# EasyEDA Pro project ProPrj_课设-温湿度传感器_2025-12-05.epro

# Schematic Schematic1
Board Name: Board1; Create Date: 2025-11-25; Page Name: P1; Project Name: 课设-温湿度传感器; Schematic Name: Schematic1; Update Date: 2025-11-25; Company: 嘉立创EDA; Page Size: A4; Version: V1.0
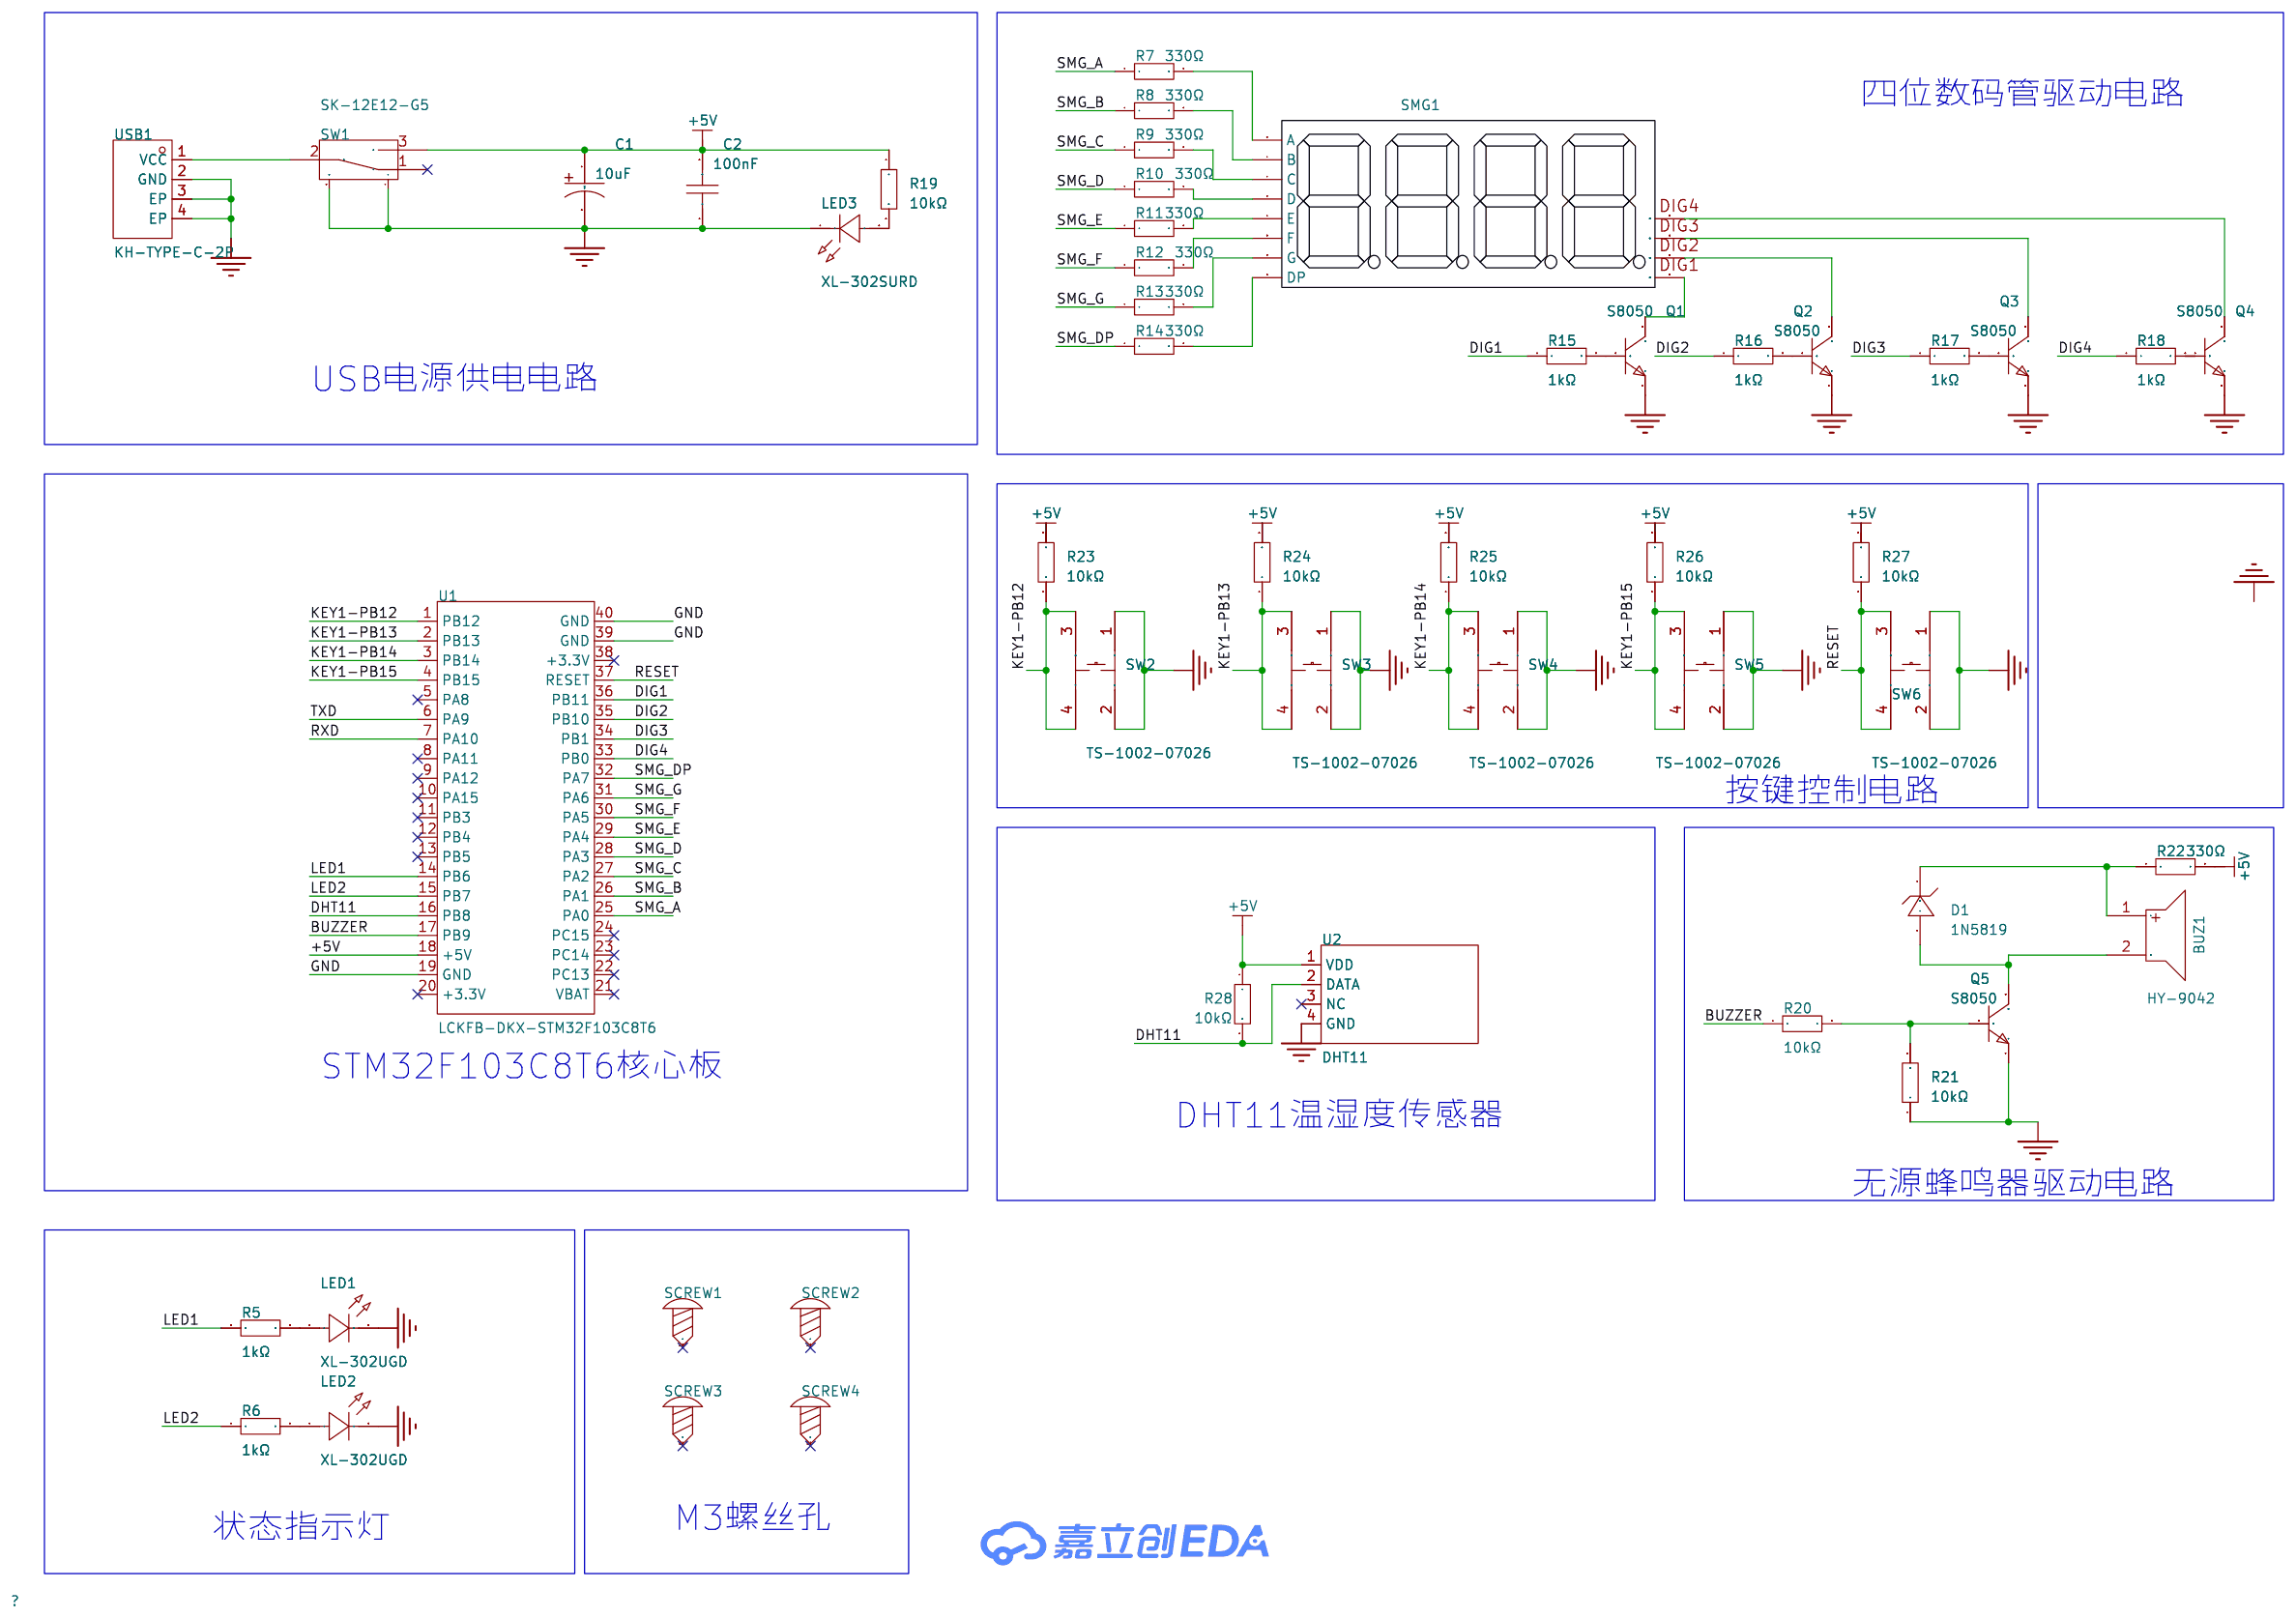
[diagram p0: schematic sheet]

## Parts
BUZ1  HY-9042  [BUZ-TH_BD9.0-P4.00-D0.6-FD]
C1  10uF  [CAP-TH_BD4.0-P1.50-D0.8-FD]
C2  100nF  [CAP-TH_L5.0-W2.5-P5.08-D0.7]
D1  1N5819  [DO-41_BD2.4-L4.7-P8.70-D0.9-RD]
LED1  XL-302UGD  [LED-TH_BD3.8-P2.54-FD_GREEN]
LED2  XL-302UGD  [LED-TH_BD3.8-P2.54-FD_GREEN]
LED3  XL-302SURD  [LED-TH_BD3.8-P2.54-RD]
Q1  S8050  [TO-92-3_L4.5-W3.5-P1.27-L]
Q2  S8050  [TO-92-3_L4.5-W3.5-P1.27-L]
Q3  S8050  [TO-92-3_L4.5-W3.5-P1.27-L]
Q4  S8050  [TO-92-3_L4.5-W3.5-P1.27-L]
Q5  S8050  [TO-92-3_L4.5-W3.5-P1.27-L]
R5  1kΩ  [RES-TH_BD2.2-L6.5-P10.50-D0.6]
R6  1kΩ  [RES-TH_BD2.2-L6.5-P10.50-D0.6]
R7  330Ω  [RES-TH_BD2.2-L6.5-P10.50-D0.6]
R8  330Ω  [RES-TH_BD2.2-L6.5-P10.50-D0.6]
R9  330Ω  [RES-TH_BD2.2-L6.5-P10.50-D0.6]
R10  330Ω  [RES-TH_BD2.2-L6.5-P10.50-D0.6]
R11  330Ω  [RES-TH_BD2.2-L6.5-P10.50-D0.6]
R12  330Ω  [RES-TH_BD2.2-L6.5-P10.50-D0.6]
R13  330Ω  [RES-TH_BD2.2-L6.5-P10.50-D0.6]
R14  330Ω  [RES-TH_BD2.2-L6.5-P10.50-D0.6]
R15  1kΩ  [RES-TH_BD2.2-L6.5-P10.50-D0.6]
R16  1kΩ  [RES-TH_BD2.2-L6.5-P10.50-D0.6]
R17  1kΩ  [RES-TH_BD2.2-L6.5-P10.50-D0.6]
R18  1kΩ  [RES-TH_BD2.2-L6.5-P10.50-D0.6]
R19  10kΩ  [RES-TH_BD2.4-L6.3-P10.30-D0.6]
R20  10kΩ  [RES-TH_BD2.4-L6.3-P10.30-D0.6]
R21  10kΩ  [RES-TH_BD2.4-L6.3-P10.30-D0.6]
R22  330Ω  [RES-TH_BD2.2-L6.5-P10.50-D0.6]
R23  10kΩ  [RES-TH_BD2.4-L6.3-P10.30-D0.6]
R24  10kΩ  [RES-TH_BD2.4-L6.3-P10.30-D0.6]
R25  10kΩ  [RES-TH_BD2.4-L6.3-P10.30-D0.6]
R26  10kΩ  [RES-TH_BD2.4-L6.3-P10.30-D0.6]
R27  10kΩ  [RES-TH_BD2.4-L6.3-P10.30-D0.6]
R28  10kΩ  [RES-TH_BD2.4-L6.3-P10.30-D0.6]
SCREW1  -  [M3螺丝]
SCREW2  -  [M3螺丝]
SCREW3  -  [M3螺丝]
SCREW4  -  [M3螺丝]
SMG1  -  [LED-SEG-TH_FJ5461AH]
SW1  SK-12E12-G5  [SW-TH_SK-12E12-G5]
SW2  TS-1002-07026  [SW-TH_4P-L6.0-W6.0-P4.50-LS6.5]
SW3  TS-1002-07026  [SW-TH_4P-L6.0-W6.0-P4.50-LS6.5]
SW4  TS-1002-07026  [SW-TH_4P-L6.0-W6.0-P4.50-LS6.5]
SW5  TS-1002-07026  [SW-TH_4P-L6.0-W6.0-P4.50-LS6.5]
SW6  TS-1002-07026  [SW-TH_4P-L6.0-W6.0-P4.50-LS6.5]
U1  LCKFB-DKX-STM32F103C8T6  [CONN-TH_L53.3-W22.9_STM32F103C8T6-CARD]
U2  DHT11  [SENSOR-TH_DHT11]
USB1  KH-TYPE-C-2P  [USB-SMD_KH-TYPE-C-2P]

## Library data of the parts
BUZ1 = HY-9042: Supplier Part: C9900019261; Supplier: LCSC
C1 = KF1E100MB050A00CV0: 容值:10uF;精度:±20%;额定电压:25V;; LCSC Part Name: 10uF ±20% 25V; Supplier Part: C216306; Manufacturer: HUAWEI(华威集团); Supplier Footprint: 插件,D4xL5mm; JLCPCB Part Class: 扩展库; Datasheet: https://atta.szlcsc.com/upload/public/pdf/source/20181022/C271305_EAB36A8975ADE9B953FB348CB9D3587F.pdf; Supplier: LCSC; Tolerance: ±20%; Rated Voltage: 25V; Lead Spacing: 1.5mm; φD: 4mm; L: 5mm; Lifetime @ Temp: 1000hrs@105℃
C2 = CC1H104ZC74D3F5O30MN: 容值:100nF;精度:-20%~+80%;额定电压:50V;温度系数:Y5V;; LCSC Part Name: 100nF -20%~+80% 50V; Supplier Part: C254094; Manufacturer: Dersonic(德尔创); Supplier Footprint: 插件,P=5.08mm; JLCPCB Part Class: 扩展库; Datasheet: https://item.szlcsc.com/datasheet/CC1H104ZC74D3F5O30MN/248644.html; Supplier: LCSC; Tolerance: -20%~+80%; Voltage Rating: 50V; Pin Spacing: 5.08mm; Temperature Coefficient: Y5V; Diameter: 5.3mm; Body Thickness: 2.2mm
D1 = 1N5819_C402218: 二极管配置:独立式;正向压降(Vf):900mV@3A;直流反向耐压(Vr):40V;整流电流:1A;; LCSC Part Name: 电压:40V 电流:1A; Supplier Part: C402218; Manufacturer: LGE(鲁光); Supplier Footprint: DO-41; JLCPCB Part Class: 扩展库; Datasheet: https://item.szlcsc.com/datasheet/1N5819/387363.html; Supplier: LCSC; Diode Configuration: 独立式; Voltage - Forward(Vf@If): 900mV@3A; Voltage - DC Reverse(Vr): 40V; Current - Rectified: 1A; Reverse Leakage Current (Ir): 1mA@40V; Operating Junction Temperature Range: -65℃~+125℃; Non-Repetitive Peak Forward Surge Current: 30A
LED1 LED2 = XL-302UGD: 灯头类型:3mm圆形灯头;发光颜色:翠绿色;正向压降(Vf):3.6V;功率:70mW;正向电流:20mA;波长:520nm~530nm;透镜颜色:绿色透镜;色温:-;发光强度:3000mcd;发光角度:30°;载带方式:-;工作温度:-20℃~+85℃;; LCSC Part Name: 绿发翠绿短脚LED; Supplier Part: C2895476; Manufacturer: XINGLIGHT(成兴光); Supplier Footprint: 插件,D=3mm; JLCPCB Part Class: 扩展库; Datasheet: https://item.szlcsc.com/datasheet/XL-302UGD/3136191.html; Supplier: LCSC; Lamp Holder Type: 3mm圆形灯头; Illumination Color: 翠绿色; Voltage - Forward(Vf): 3.6V; Power(Watts): 70mW; Forward Current: 20mA; Wavelength - Dominant: 520nm~530nm; Peak Wavelength: 520nm; Lens Color: 绿色透镜; Luminous Intensity: 3000mcd; Viewing Angle: 30°; Operating Temperature: -20℃~+85℃
LED3 = XL-302SURD: 灯头类型:3mm圆形灯头;发光颜色:红色;正向压降(Vf):2.2V;功率:50mW;正向电流:20mA;波长:620nm~630nm;二极管配置:-;透镜颜色:红色透镜;色温:-;发光强度:1000mcd;发光角度:35°;载带方式:-;工作温度:-20℃~+85℃;; Supplier Part: C2895470; Manufacturer: XINGLIGHT(成兴光); Supplier Footprint: 插件,D=3mm; JLCPCB Part Class: 扩展库; Datasheet: https://item.szlcsc.com/datasheet/XL-302SURD/3136185.html; Supplier: LCSC; Lamp Holder Type: 3mm圆形灯头; Illumination Color: 红色; Voltage - Forward(Vf): 2.2V; Power(Watts): 50mW; Forward Current: 20mA; Wavelength - Dominant: 620nm~630nm; Peak Wavelength: 625nm; Lens Color: 红色透镜; Luminous Intensity: 1000mcd; Viewing Angle: 35°; Operating Temperature: -20℃~+85℃
Q1-Q5 = S8050_C2931492: 晶体管类型:NPN;集电极电流(Ic):500mA;集射极击穿电压(Vceo):25V;耗散功率(Pd):625mW;直流电流增益(hFE):160@50mA,1V;; LCSC Part Name: NPN 电流:500mA 电压:25V; Supplier Part: C2931492; Manufacturer: JSMSEMI(杰盛微); Supplier Footprint: TO-92; JLCPCB Part Class: 扩展库; Datasheet: https://item.szlcsc.com/datasheet/S8050/3272796.html; Supplier: LCSC; type: NPN; Current - Collector(Ic): 500mA; Collector - Emitter Voltage VCEO: 25V; Pd - Power Dissipation: 625mW; DC Current Gain: 160@50mA,1V; Transition frequency(fT): 150MHz; Current - Collector Cutoff: 100nA; Vce Saturation(VCE(sat)): 600mV@500mA,50mA; Emitter-Base Voltage(Vebo): 5V
R5 R6 R15-R18 = MFR-25JT-52-1K: 电阻类型:金属膜电阻;阻值:1kΩ;精度:±5%;功率:250mW;; LCSC Part Name: 金属膜电阻 1kΩ ±5% 250mW 铜脚，圆柱状直插; Supplier Part: C176465; Manufacturer: YAGEO(国巨); Supplier Footprint: 插件,D2.4xL6.3mm; JLCPCB Part Class: 扩展库; Datasheet: https://atta.szlcsc.com/upload/public/pdf/source/20191118/C457825_18355E864DE4965678DC27B0EBC3E21E.pdf; Supplier: LCSC; Type: 金属膜电阻; Tolerance: ±5%; Power(Watts): 250mW; Operating Temperature: -55℃~+155℃
R7-R14 R22 = MFR-25FTE52-330R: 电阻类型:金属膜电阻;阻值:330Ω;精度:±1%;功率:250mW;温度系数:±50ppm/℃;; LCSC Part Name: 金属膜电阻 330Ω ±1% 250mW 铜脚，圆柱状直插; Supplier Part: C138208; Manufacturer: YAGEO(国巨); Supplier Footprint: 插件,D2.4xL6.3mm; JLCPCB Part Class: 扩展库; Datasheet: https://atta.szlcsc.com/upload/public/pdf/source/20191118/C457825_18355E864DE4965678DC27B0EBC3E21E.pdf; Supplier: LCSC; Type: 金属膜电阻; Tolerance: ±1%; Power(Watts): 250mW; Temperature Coefficient: ±50ppm/℃; Operating Temperature: -55℃~+155℃
R19-R21 R23-R28 = MFR-25JT-52-10K: 电阻类型:金属膜电阻;阻值:10kΩ;精度:±5%;功率:250mW;; LCSC Part Name: 金属膜电阻 10kΩ ±5% 250mW 铜脚，圆柱状直插; Supplier Part: C176451; Manufacturer: YAGEO(国巨); Supplier Footprint: 插件,D2.4xL6.3mm; JLCPCB Part Class: 扩展库; Datasheet: https://item.szlcsc.com/datasheet/MFR-25JT-52-10K/187841.html; Supplier: LCSC; Type: 金属膜电阻; Tolerance: ±5%; Power(Watts): 250mW; Operating Temperature: -55℃~+155℃
SCREW1-SCREW4 = M3螺丝: Supplier Footprint: 插件
SMG1 = LED_SEG_TH_0.56x4: Supplier Footprint: 插件
SW1 = SK-12E12-G5: 电路结构:单刀双掷;安装方式:-;额定电流:-;额定电压:-;工作寿命:5千次;; LCSC Part Name: 卧插双档 滑动开关; Supplier Part: C136720; Manufacturer: 韩国韩荣; Supplier Footprint: 插件; JLCPCB Part Class: 扩展库; Datasheet: https://item.szlcsc.com/datasheet/SK-12E12-G5/148036.html; Supplier: LCSC; Circuit: 单刀双掷; Actuator Style: 矩形柱状; Termination Style: PC引脚; Switch Height: 10.6mm; Life: 5千次; Operating Temperature: -25℃~+70℃
SW2-SW6 = TS-1002-07026: 电路结构:单刀单掷;按钮形状:圆形按钮;安装方式:直插;开关长度:6mm;开关宽度:6mm;开关高度:7mm;触点电流:50mA;额定电压:12V;带灯:-;工作寿命:-;; LCSC Part Name: 6*6*7mm 直插 轻触开关; Supplier Part: C455095; Manufacturer: XUNPU(讯普); Supplier Footprint: 插件,6x6mm; JLCPCB Part Class: Extended Part; Datasheet: https://item.szlcsc.com/datasheet/TS-1002-07026/457500.html; Supplier: LCSC; Circuit: 单刀单掷; Actuator Style: 圆形按钮; Mounting Type: 直插; Length: 6mm; Width: 6mm; Switch Height: 7mm; Contact Current: 50mA; Voltage Rating: 12V
U1 = LCKFB-DKX-STM32F103C8T6: LCSC Part Name: 立创·地阔星-STM32F103C8T6开发板; Supplier Part: C22396880; Manufacturer: 立创开发板; JLCPCB Part Class: 扩展库; Datasheet: https://item.szlcsc.com/datasheet/LCKFB-DKX-STM32F103C8T6/24005615.html; Supplier: LCSC
U2 = DHT11: 新款电容式数字温湿度传感器,老款已停产16.1x12.6x5.8mm; LCSC Part Name: 新款电容式数字温湿度传感器,老款已停产16.1x12.6x5.8mm DHT11  电容式传感器; Supplier Part: C117051; Manufacturer: 广州奥松; Supplier Footprint: SIP-4; JLCPCB Part Class: 扩展库; Datasheet: https://atta.szlcsc.com/upload/public/pdf/source/20170703/1499081238365.pdf; Supplier: LCSC
USB1 = KH-TYPE-C-2P: 连接器类型:Type-C;协议标准:-;公母:-;安装方式:-;触点数量:2P;端口数量:-;额定电流 - 电源:-;工作温度:-;; LCSC Part Name: Type-C; Supplier Part: C2919656; Manufacturer: kinghelm(金航标); Supplier Footprint: 插件; JLCPCB Part Class: 扩展库; Datasheet: https://item.szlcsc.com/datasheet/KH-TYPE-C-2P/3222638.html; Supplier: LCSC; Connector Type: Type-C; Number of Contacts: 2P

## Nets
+5V: C1.1 C2.2 R19.1 R22.2 R23.2 R24.2 R25.2 R26.2 R27.2 R28.1 SW1.3 U1.18(+5V) U2.1(VDD)
GND: C1.2 C2.1 LED1.2(K) LED2.2(K) LED3.1(K) Q1.1(E) Q2.1(E) Q3.1(E) Q4.1(E) Q5.1(E) R21.1 SW1.4 SW1.5 SW2.1 SW2.2 SW3.1 SW3.2 SW4.1 SW4.2 SW5.1 SW5.2 SW6.1 SW6.2 U1.19(GND) U1.39(GND) U1.40(GND) U2.4(GND) USB1.2(GND) USB1.3(EP) USB1.4(EP)
BUZZER: R20.1 U1.17(PB9)
DHT11: R28.2 U1.16(PB8) U2.2(DATA)
DIG1: R15.1 U1.36(PB11)
DIG2: R16.1 U1.35(PB10)
DIG3: R17.1 U1.34(PB1)
DIG4: R18.1 U1.33(PB0)
KEY1-PB12: R23.1 SW2.3 SW2.4 U1.1(PB12)
KEY1-PB13: R24.1 SW3.3 SW3.4 U1.2(PB13)
KEY1-PB14: R25.1 SW4.3 SW4.4 U1.3(PB14)
KEY1-PB15: R26.1 SW5.3 SW5.4 U1.4(PB15)
LED1: R5.1 U1.14(PB6)
LED2: R6.1 U1.15(PB7)
RESET: R27.1 SW6.3 SW6.4 U1.37(RESET)
RXD: U1.7(PA10)
SMG_A: R7.1 U1.25(PA0)
SMG_B: R8.1 U1.26(PA1)
SMG_C: R9.1 U1.27(PA2)
SMG_D: R10.1 U1.28(PA3)
SMG_DP: R14.1 U1.32(PA7)
SMG_E: R11.1 U1.29(PA4)
SMG_F: R12.1 U1.30(PA5)
SMG_G: R13.1 U1.31(PA6)
TXD: U1.6(PA9)
$1N1388: R7.2 SMG1.11(A)
$1N1393: R8.2 SMG1.7(B)
$1N1403: R9.2 SMG1.4(C)
$1N1413: R10.2 SMG1.2(D)
$1N1419: R11.2 SMG1.1(E)
$1N1425: R12.2 SMG1.10(F)
$1N1432: R13.2 SMG1.5(G)
$1N1474: R14.2 SMG1.3(DP)
$1N1913: Q1.3(C) SMG1.12(DIG1)
$1N1916: Q1.2(B) R15.2
$1N1920: Q2.3(C) SMG1.9(DIG2)
$1N1925: Q3.3(C) SMG1.8(DIG3)
$1N1934: Q4.3(C) SMG1.6(DIG4)
$1N1943: Q2.2(B) R16.2
$1N1945: Q3.2(B) R17.2
$1N1947: Q4.2(B) R18.2
$1N2445: SW1.2 USB1.1(VCC)
$1N2605: LED3.2(A) R19.2
$1N2609: LED1.1(A) R5.2
$1N2614: LED2.1(A) R6.2
$1N3034: Q5.2(B) R20.2 R21.2
$1N3101: BUZ1.2 D1.2(A) Q5.3(C)
$1N3230: BUZ1.1 D1.1(C) R22.1

Not connected (* = marked no-connect by the designer): SCREW1 1*; SCREW2 1*; SCREW3 1*; SCREW4 1*; SW1 1*; U1 5(PA8)* 8(PA11)* 9(PA12)* 10(PA15)* 11(PB3)* 12(PB4)* 13(PB5)* 20(+3.3V)* 21(VBAT)* 22(PC13)* 23(PC14)* 24(PC15)* 38(+3.3V)*; U2 3(NC)*

## Notes on the sheet
- 四位数码管驱动电路
- USB电源供电电路
- 按键控制电路
- STM32F103C8T6核心板
- DHT11温湿度传感器
- 无源蜂鸣器驱动电路
- 状态指示灯
- M3螺丝孔

# Board PCB1
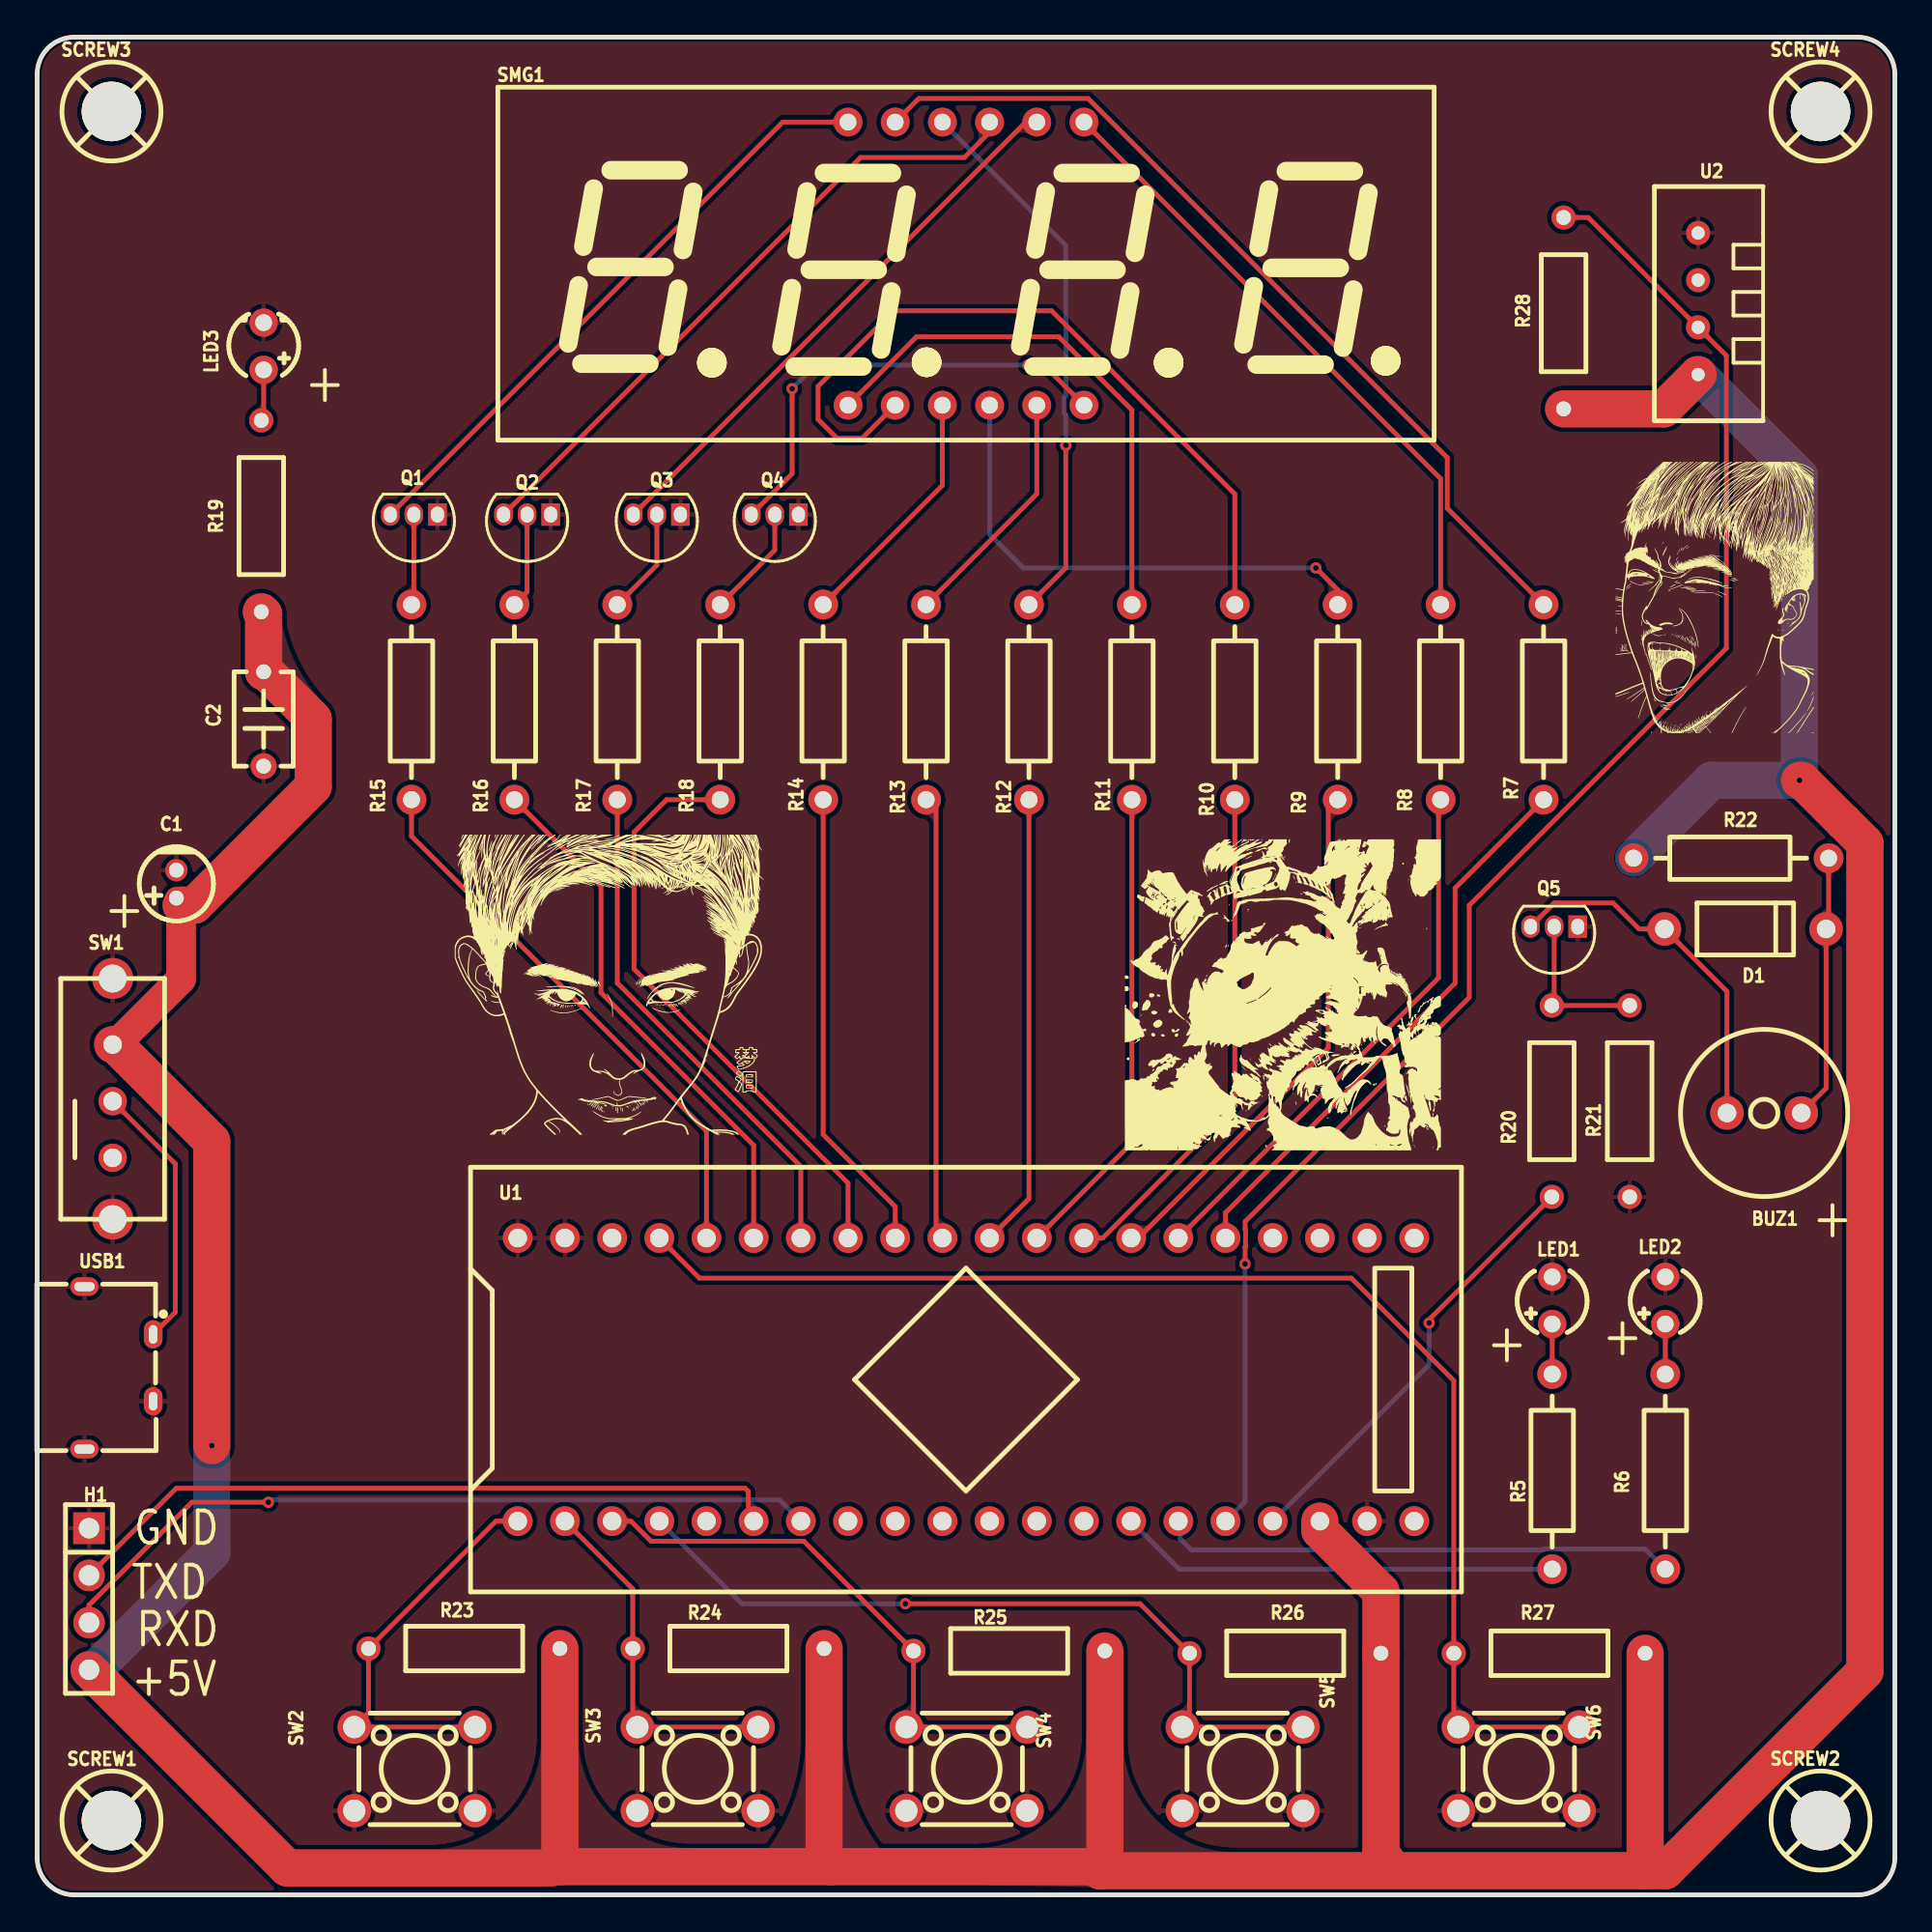
[diagram p1: board, top side]
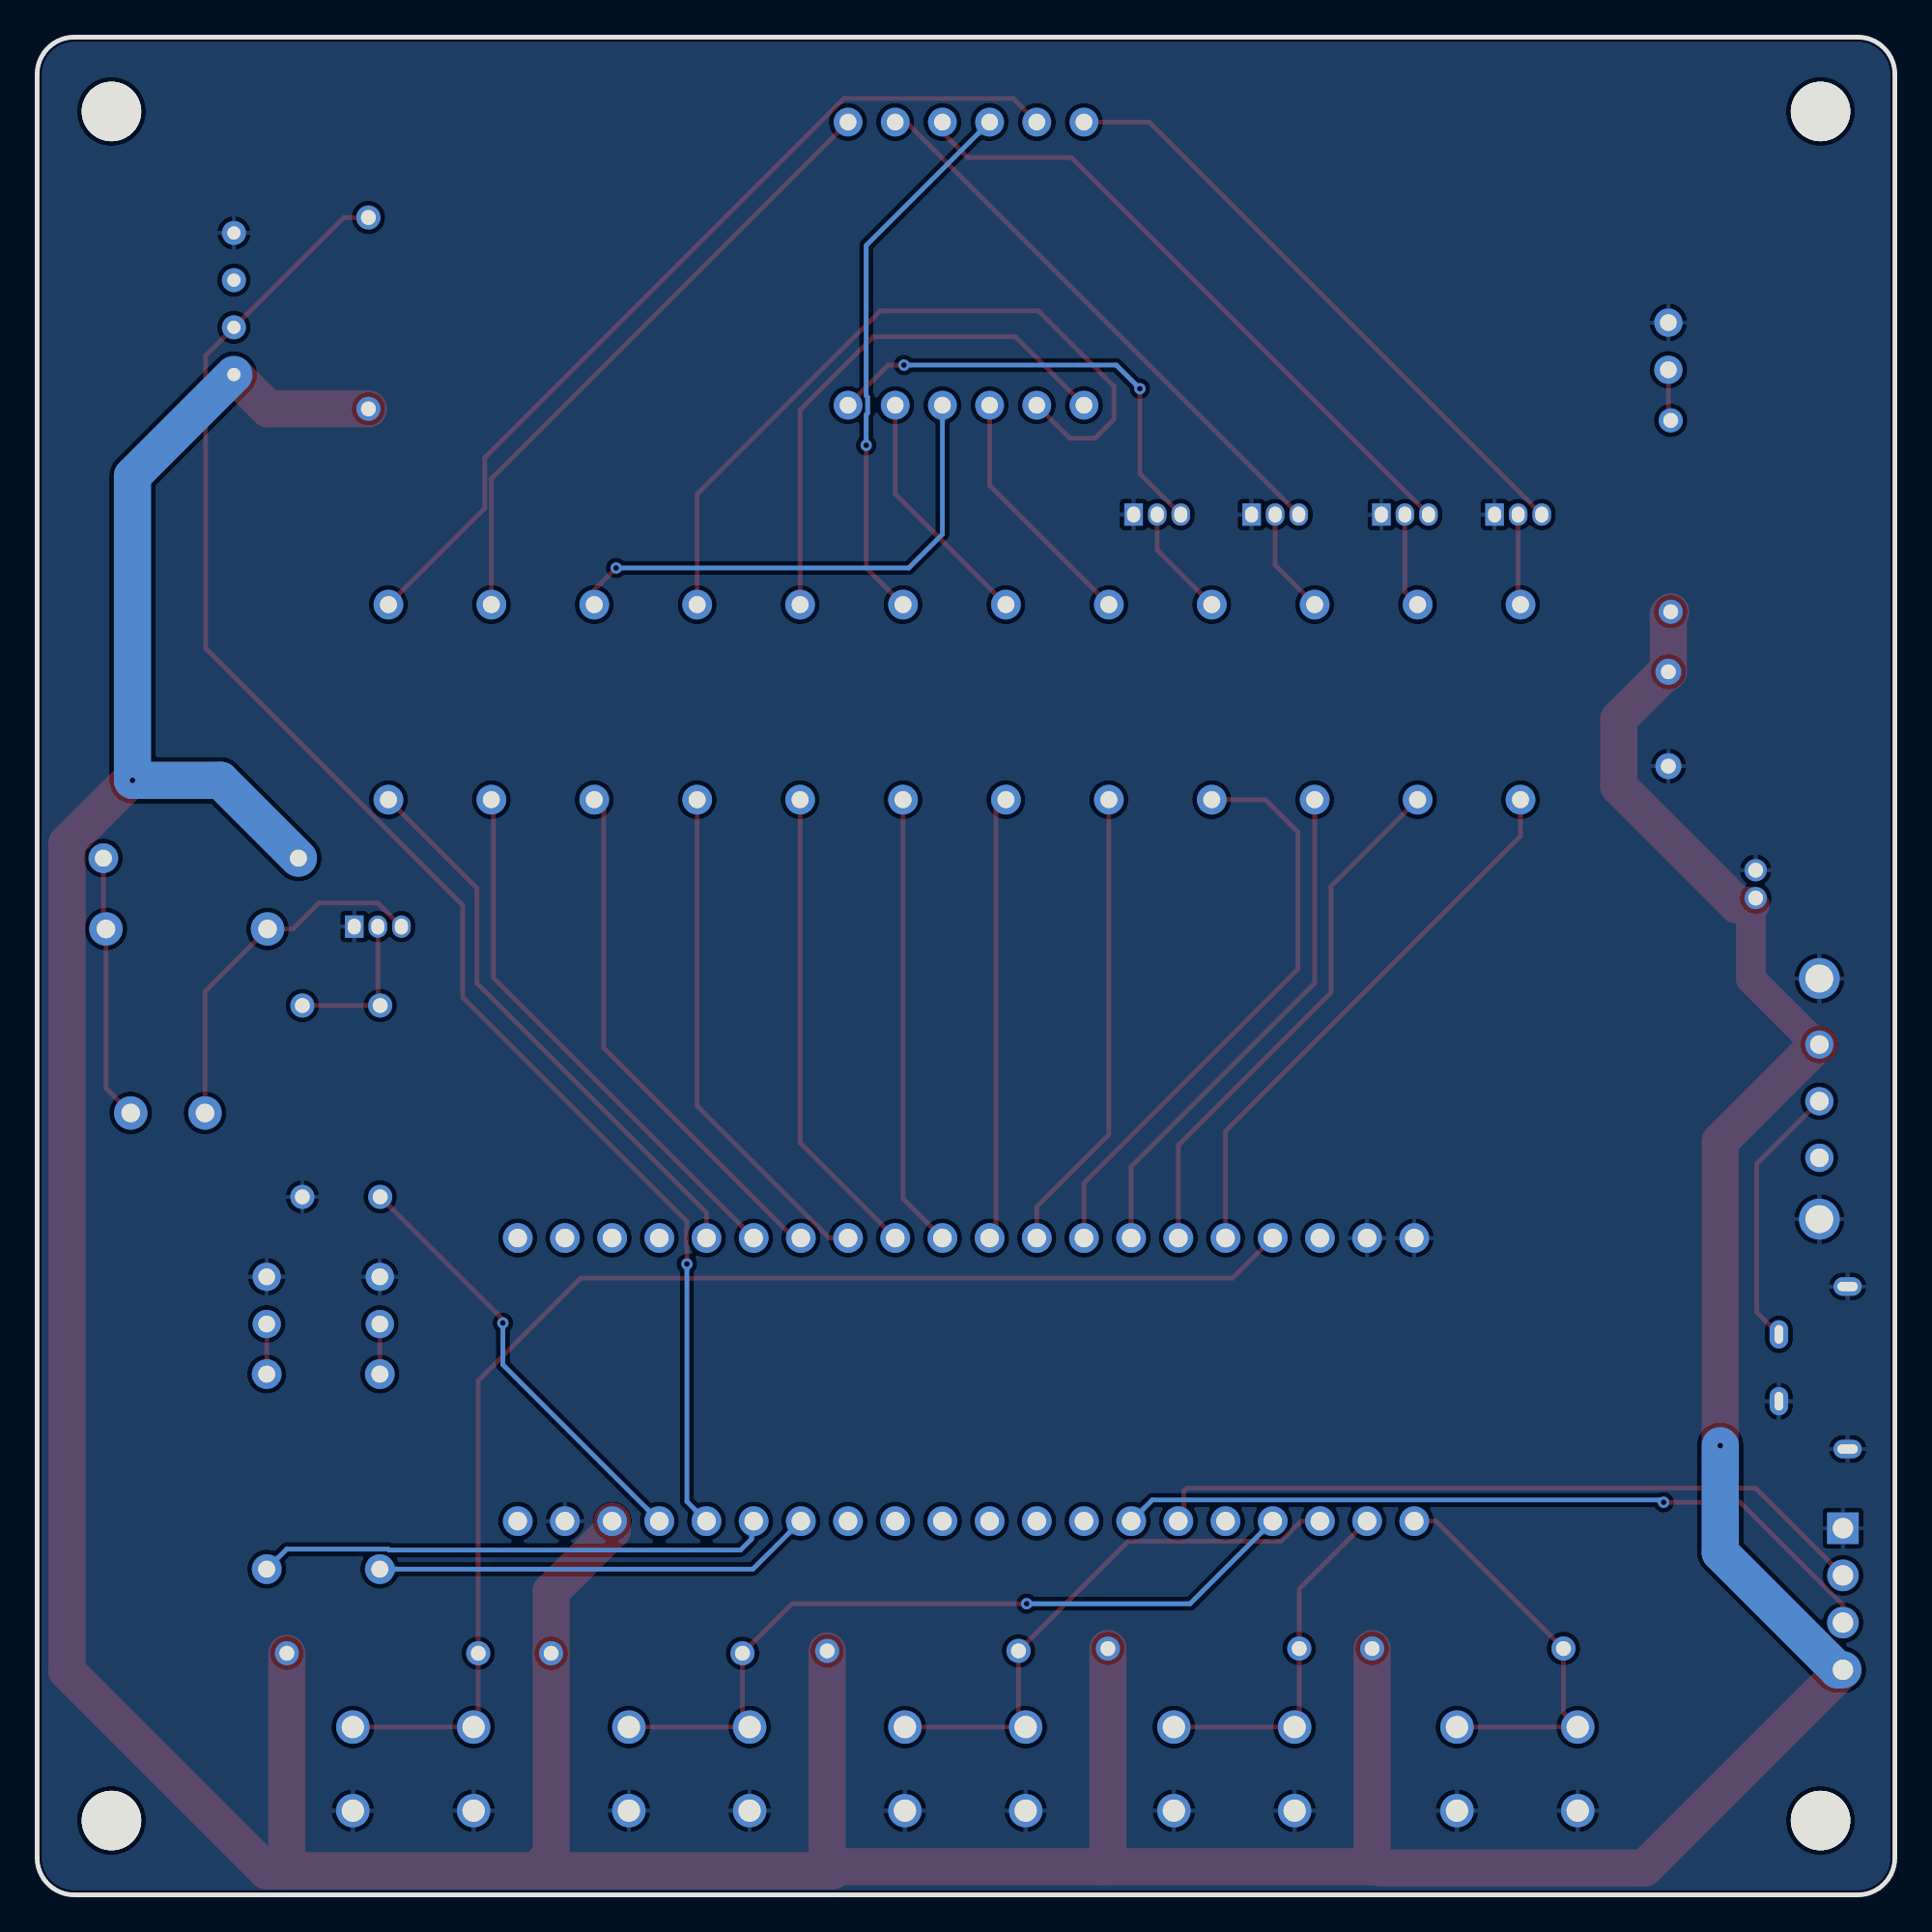
[diagram p2: board, bottom side, seen from below]

Outline 100 x 100 mm; copper layers: Top Layer, Bottom Layer. Coordinates in mm from the lower left corner of the outline.
Outline path: 0,98 0,2 arc(0.59,0.59) 2,0 98,0 arc(99.41,0.59) 100,2 100,98 arc(99.41,99.41) 98,100 2,100 arc(0.59,99.41) 0,98
Stack: Top Layer 0.035mm / Dielectric1 1.51mm FR4 er 4.5 / Bottom Layer 0.035mm

## Design rules (mm)
template: JLCPCB Capability(Two Layers Board)
spacing copperThickness1oz (default): track to track 0.102, other pairs 0.152 to 0.3
spacing copperThickness2oz: track to track 0.203, other pairs 0.152 to 0.3
track width copperThickness1oz (default): min 0.127, default 0.254, max 2.54
track width copperThickness2oz: min 0.203, default 0.254, max 2.54
differential pair differentialPair (default): width min 0.127, default 0.254, max 2.54; gap min 0.152, default 0.152
via viaSize (default): diameter min 0.5, default 0.61, max 10; hole min 0.3, default 0.305, max 6.3

## Placement (name value [footprint] x y rotation side)
BUZ1  HY-9042  [BUZ-TH_BD9.0-P4.00-D0.6-FD]  92.96 42.09 180 top
C1  10uF  [CAP-TH_BD4.0-P1.50-D0.8-FD]  7.49 54.41 90 top
C2  100nF  [CAP-TH_L5.0-W2.5-P5.08-D0.7]  12.19 63.3 90 top
D1  1N5819  [DO-41_BD2.4-L4.7-P8.70-D0.9-RD]  91.95 51.99 180 top
H1  PZ254V-11-04P  [HDR-TH_4P-P2.54-V-M]  2.79 15.93 270 top
LED1  XL-302UGD  [LED-TH_BD3.8-P2.54-FD_GREEN]  81.56 32 90 top
LED2  XL-302UGD  [LED-TH_BD3.8-P2.54-FD_GREEN]  87.64 32 90 top
LED3  XL-302SURD  [LED-TH_BD3.8-P2.54-RD]  12.19 83.36 270 top
Q1  S8050  [TO-92-3_L4.5-W3.5-P1.27-L]  20.28 74.3 180 top
Q2  S8050  [TO-92-3_L4.5-W3.5-P1.27-L]  26.37 74.3 180 top
Q3  S8050  [TO-92-3_L4.5-W3.5-P1.27-L]  33.36 74.3 180 top
Q4  S8050  [TO-92-3_L4.5-W3.5-P1.27-L]  39.71 74.3 180 top
Q5  S8050  [TO-92-3_L4.5-W3.5-P1.27-L]  81.66 52.12 180 top
R5  1kΩ  [RES-TH_BD2.2-L6.5-P10.50-D0.6]  81.56 22.78 90 top
R6  1kΩ  [RES-TH_BD2.2-L6.5-P10.50-D0.6]  87.64 22.78 90 top
R7  330Ω  [RES-TH_BD2.2-L6.5-P10.50-D0.6]  81.09 64.2 90 top
R8  330Ω  [RES-TH_BD2.2-L6.5-P10.50-D0.6]  75.55 64.2 90 top
R9  330Ω  [RES-TH_BD2.2-L6.5-P10.50-D0.6]  70.01 64.2 90 top
R10  330Ω  [RES-TH_BD2.2-L6.5-P10.50-D0.6]  64.47 64.2 90 top
R11  330Ω  [RES-TH_BD2.2-L6.5-P10.50-D0.6]  58.93 64.2 90 top
R12  330Ω  [RES-TH_BD2.2-L6.5-P10.50-D0.6]  53.39 64.2 90 top
R13  330Ω  [RES-TH_BD2.2-L6.5-P10.50-D0.6]  47.85 64.2 90 top
R14  330Ω  [RES-TH_BD2.2-L6.5-P10.50-D0.6]  42.31 64.2 90 top
R15  1kΩ  [RES-TH_BD2.2-L6.5-P10.50-D0.6]  20.15 64.2 90 top
R16  1kΩ  [RES-TH_BD2.2-L6.5-P10.50-D0.6]  25.69 64.2 90 top
R17  1kΩ  [RES-TH_BD2.2-L6.5-P10.50-D0.6]  31.23 64.2 90 top
R18  1kΩ  [RES-TH_BD2.2-L6.5-P10.50-D0.6]  36.77 64.2 90 top
R19  10kΩ  [RES-TH_BD2.4-L6.3-P10.30-D0.6]  12.06 74.22 90 top
R20  10kΩ  [RES-TH_BD2.4-L6.3-P10.30-D0.6]  81.53 42.72 90 top
R21  10kΩ  [RES-TH_BD2.4-L6.3-P10.30-D0.6]  85.72 42.72 90 top
R22  330Ω  [RES-TH_BD2.2-L6.5-P10.50-D0.6]  91.19 55.8 180 top
R23  10kΩ  [RES-TH_BD2.4-L6.3-P10.30-D0.6]  22.99 13.26 0 top
R24  10kΩ  [RES-TH_BD2.4-L6.3-P10.30-D0.6]  37.21 13.26 0 top
R25  10kΩ  [RES-TH_BD2.4-L6.3-P10.30-D0.6]  52.32 13.13 0 top
R26  10kΩ  [RES-TH_BD2.4-L6.3-P10.30-D0.6]  67.18 13 0 top
R27  10kΩ  [RES-TH_BD2.4-L6.3-P10.30-D0.6]  81.41 13 0 top
R28  10kΩ  [RES-TH_BD2.4-L6.3-P10.30-D0.6]  82.17 85.14 90 top
SCREW1  -  [M3螺丝]  4 4 0 top
SCREW2  -  [M3螺丝]  96 4 0 top
SCREW3  -  [M3螺丝#2]  4 96 0 top
SCREW4  -  [M3螺丝]  96 96 0 top
SMG1  -  [LED-SEG-TH_FJ5461AH]  50 87.81 0 top
SW1  SK-12E12-G5  [SW-TH_SK-12E12-G5]  4.06 42.85 180 top
SW2  TS-1002-07026  [SW-TH_4P-L6.0-W6.0-P4.50-LS6.5]  20.32 6.78 180 top
SW3  TS-1002-07026  [SW-TH_4P-L6.0-W6.0-P4.50-LS6.5]  35.56 6.78 180 top
SW4  TS-1002-07026  [SW-TH_4P-L6.0-W6.0-P4.50-LS6.5]  50.04 6.78 180 top
SW5  TS-1002-07026  [SW-TH_4P-L6.0-W6.0-P4.50-LS6.5]  64.9 6.78 180 top
SW6  TS-1002-07026  [SW-TH_4P-L6.0-W6.0-P4.50-LS6.5]  79.76 6.78 180 top
U1  LCKFB-DKX-STM32F103C8T6  [CONN-TH_L53.3-W22.9_STM32F103C8T6-CARD]  50 27.74 0 top
U2  DHT11  [SENSOR-TH_DHT11]  89.41 85.65 90 top
USB1  KH-TYPE-C-2P  [USB-SMD_KH-TYPE-C-2P]  4.39 28.37 270 top

## Footprints (pads in the part's own frame, mm; a bottom-side part is the same pattern mirrored in y, then rotated)
BUZ-TH_BD9.0-P4.00-D0.6-FD
  round 1.8 hole 1: 1(-2,0) 2(2,0)
CAP-TH_BD4.0-P1.50-D0.8-FD
  round 1.2 hole 0.8: 1(-0.75,0) 2(0.75,0)
CAP-TH_L5.0-W2.5-P5.08-D0.7
  round 1.4 hole 0.8: 1(-2.54,0) 2(2.54,0)
CONN-TH_L53.3-W22.9_STM32F103C8T6-CARD
  round 1.6 hole 1: 1(-24.13,-7.62) 2(-21.59,-7.62) 3(-19.05,-7.62) 4(-16.51,-7.62) 5(-13.97,-7.62) 6(-11.43,-7.62) 7(-8.89,-7.62) 8(-6.35,-7.62) 9(-3.81,-7.62) 10(-1.27,-7.62) 11(1.27,-7.62) 12(3.81,-7.62) 13(6.35,-7.62) 14(8.89,-7.62) 15(11.43,-7.62) 16(13.97,-7.62) 17(16.51,-7.62) 18(19.05,-7.62) 19(21.59,-7.62) 20(24.13,-7.62) 21(24.13,7.62) 22(21.59,7.62) 23(19.05,7.62) 24(16.51,7.62) 25(13.97,7.62) 26(11.43,7.62) 27(8.89,7.62) 28(6.35,7.62) 29(3.81,7.62) 30(1.27,7.62) 31(-1.27,7.62) 32(-3.81,7.62) 33(-6.35,7.62) 34(-8.89,7.62) 35(-11.43,7.62) 36(-13.97,7.62) 37(-16.51,7.62) 38(-19.05,7.62) 39(-21.59,7.62) 40(-24.13,7.62)
DO-41_BD2.4-L4.7-P8.70-D0.9-RD
  round 1.8 hole 1: 1(-4.35,0) 2(4.35,0)
HDR-TH_4P-P2.54-V-M
  rect 1.7x1.7 hole 1.1: 1(-3.81,0)
  round 1.7 hole 1.1: 2(-1.27,0) 3(1.27,0) 4(3.81,0)
LED-SEG-TH_FJ5461AH
  round 1.55 hole 0.9: 1(-6.35,-7.62) 2(-3.81,-7.62) 3(-1.27,-7.62) 4(1.27,-7.62) 5(3.81,-7.62) 6(6.35,-7.62) 7(6.35,7.62) 8(3.81,7.62) 9(1.27,7.62) 10(-1.27,7.62) 11(-3.81,7.62) 12(-6.35,7.62)
LED-TH_BD3.8-P2.54-FD_GREEN
  round 1.524 hole 0.9: 1(-1.27,0) 2(1.27,0)
LED-TH_BD3.8-P2.54-RD
  round 1.524 hole 0.9: 1(-1.27,0) 2(1.27,0)
M3螺丝
  round 3.2 hole 3.2: 1(0,0)
M3螺丝#2
  round 3.2 hole 3.2x3.2: 1(0,0)
RES-TH_BD2.2-L6.5-P10.50-D0.6
  round 1.6 hole 0.914: 1(-5.25,0) 2(5.25,0)
RES-TH_BD2.4-L6.3-P10.30-D0.6
  round 1.3 hole 0.8: 1(-5.15,0) 2(5.15,0)
SENSOR-TH_DHT11
  rect 1.296x1.296 hole 0.711: 1(-3.81,0)
  round 1.296 hole 0.711: 2(-1.27,0) 3(1.27,0) 4(3.81,0)
SW-TH_4P-L6.0-W6.0-P4.50-LS6.5
  round 1.8 hole 1.2: 1(-3.25,2.25) 2(3.25,2.25) 3(-3.25,-2.25) 4(3.25,-2.25)
SW-TH_SK-12E12-G5
  round 1.524 hole 1: 1(0,3.175) 2(0,0.127) 3(0,-2.921)
  round 2.2 hole 1.5: 4(0,-6.477) 5(0,6.477)
TO-92-3_L4.5-W3.5-P1.27-L
  rect 1x1.2 hole 0.7x0.85: 1(-1.27,0)
  oval 1x1.2 hole 0.7x0.85: 2(0,0) 3(1.27,0)
USB-SMD_KH-TYPE-C-2P
  oval 1.524x1 hole 1x0.45: 1(-1.8,1.85) 2(1.8,1.85)
  oval 1x1.524 hole 0.5x1.1: 3(4.375,-1.85) 4(-4.375,-1.85)

## Nets
As in the schematic, except:
+5V: C1.1 C2.2 H1.4 R19.1 R22.2 R23.2 R24.2 R25.2 R26.2 R27.2 R28.1 SW1.3 U1.18 U2.1
GND: C1.2 C2.1 H1.1 LED1.2 LED2.2 LED3.1 Q1.1 Q2.1 Q3.1 Q4.1 Q5.1 R21.1 SW1.4 SW1.5 SW2.1 SW2.2 SW3.1 SW3.2 SW4.1 SW4.2 SW5.1 SW5.2 SW6.1 SW6.2 U1.19 U1.39 U1.40 U2.4 USB1.2 USB1.3 USB1.4
RXD: H1.3 U1.7
TXD: H1.2 U1.6

Pads without a net: SCREW1 1; SCREW2 1; SCREW3 1; SCREW4 1; SW1 1; U1 5 8 9 10 11 12 13 20 21 22 23 24 38; U2 3

## Via types
v1: diameter 0.61, hole 0.305, Top Layer to Bottom Layer, 10 vias

## Routing (per net, layer and track width the routed paths; a pad name or vN(x,y) marks a point on that pad's centre or on a via; arc(x,y) is an arc through that point)
+5V: length 331.7
  Top Layer w0.254: 86.56,1.14 86.49,1.07
  Top Layer w1.6: 7.75,53.28 7.75,49.3 4.22,45.77
  Top Layer w2: 57.19,1.3 57.47,1.58 R25.2 ; 57.19,1.3 86.56,1.3 ; 57.19,1.3 56.97,1.52 42.72,1.52 ; R28.1 87.56,79.99 U2.1 ; v1(94.87,60) 95,60 97.24,57.76 97.24,57.76 98.39,56.61 98.39,12.04 87.65,1.3 86.56,1.3 ; 86.56,1.3 86.56,13 ; 42.72,1.52 42.36,1.88 42.36,13.26 ; 42.72,1.52 28.14,1.52 R23.2 ; 7.75,53.28 8.47,53.28 14.86,59.66 14.86,63.3 12.32,65.84 C2.2 12.19,68.94 R19.1 ; 72.64,1.83 72.33,2.14 R26.2 72.33,16.33 69.05,19.61 U1.18 ; H1.4 13.46,1.45 27.69,1.45 ; SW1.3 4.19,45.77 9.4,40.56 v1(9.4,24.18)
  Bottom Layer w2: U2.1 94.87,76.38 v1(94.87,60) 90.13,60 R22.2 ; v1(9.4,24.18) 9.4,18.43 3.09,12.12 H1.4
BUZZER: length 23.7
  Top Layer w0.254: v1(74.93,30.78) 74.93,30.97 R20.1
  Bottom Layer w0.254: U1.17 74.93,28.54 v1(74.93,30.78)
DHT11: length 85.8
  Top Layer w0.254: v1(65.02,33.96) 65.02,34.89 65.05,34.91 65.05,35.8 65.02,35.83 65.02,36.25 77.09,48.31 77.09,53.26 90.93,67.11 90.93,82.86 U2.2 83.5,90.29 R28.2
  Bottom Layer w0.254: U1.16 65.02,21.17 v1(65.02,33.96)
DIG1: length 30.2
  Top Layer w0.254: R15.1 20.15,56.99 36.03,41.11 U1.36
DIG2: length 28.9
  Top Layer w0.254: R16.1 30.35,54.29 30.35,48.56 38.57,40.35 U1.35
DIG3: length 27.7
  Top Layer w0.254: R17.1 31.23,49.08 41.11,39.2 U1.34
DIG4: length 32
  Top Layer w0.254: U1.33 43.65,38.32 32.13,49.83 32.13,57.2 33.88,58.95 R18.1
KEY1-PB12: length 21.9
  Top Layer w0.254: U1.1 24.69,20.12 R23.1 17.84,9.8 SW2.4 SW2.3
KEY1-PB13: length 19.2
  Top Layer w0.254: U1.2 32.06,16.47 R24.1 32.06,9.28 SW3.4 SW3.3
KEY1-PB14: length 29.8
  Top Layer w0.254: 46.96,9.2 47.13,9.03 SW4.3 ; 46.96,9.2 47.17,9.42 R25.1 41.27,19.04 33.04,19.04 31.96,20.12 U1.3 ; 46.96,9.2 SW4.4
KEY1-PB15: length 42.1
  Top Layer w0.254: v1(46.74,15.67) 59.37,15.67 R26.1 62.03,9.42 SW5.4 SW5.3
  Bottom Layer w0.254: U1.4 37.94,15.67 v1(46.74,15.67)
LED1: length 23.7
  Bottom Layer w0.254: R5.1 61.48,17.53 U1.14
LED2: length 27.8
  Bottom Layer w0.254: U1.15 61.54,20 61.54,19.15 62.14,18.56 81.06,18.56 81.11,18.61 86.56,18.61 R6.1
RESET: length 71.2
  Top Layer w0.254: U1.37 35.65,33.2 70.74,33.2 76.26,27.68 R27.1 76.26,9.28 SW6.4 SW6.3
RXD: length 42.1
  Top Layer w0.254: v1(12.45,21.13) 8.33,21.13 2.79,15.6 H1.3
  Bottom Layer w0.254: v1(12.45,21.13) 12.57,21.26 39.97,21.26 U1.7
SMG_A: length 30.7
  Top Layer w0.254: U1.25 63.97,36.72 76.33,49.07 76.33,54.19 R7.1
SMG_B: length 29.4
  Top Layer w0.254: R8.1 75.44,58.84 75.44,49.36 U1.26
SMG_C: length 28.4
  Top Layer w0.254: U1.27 59.02,35.48 59.4,35.48 69.5,45.59 69.5,58.45 R9.1
SMG_D: length 27.6
  Top Layer w0.254: R10.1 64.47,42.46 57.36,35.36 U1.28
SMG_DP: length 25.2
  Top Layer w0.254: U1.32 46.19,37.05 42.31,40.93 R14.1
SMG_E: length 25.7
  Top Layer w0.254: R11.1 58.93,40.48 U1.29
SMG_F: length 24.5
  Top Layer w0.254: R12.1 53.39,37.48 U1.30
SMG_G: length 24
  Top Layer w0.254: U1.31 48.39,35.7 48.39,58.42 R13.1
TXD: length 39.2
  Top Layer w0.254: H1.2 7.49,21.9 38.1,21.9 38.28,21.72 38.28,20.41 U1.6
$1N1388: length 48.3
  Top Layer w0.254: SMG1.11 47.46,96.7 56.57,96.7 75.91,77.36 75.91,74.64 R7.2
$1N1393: length 33.9
  Top Layer w0.254: R8.2 75.55,76.23 SMG1.7
$1N1403: length 27.7
  Top Layer w0.254: v1(68.83,71.42) 70.01,70.25 R9.2
  Bottom Layer w0.254: v1(68.83,71.42) 53.09,71.42 51.27,73.24 SMG1.4
$1N1413: length 41.2
  Top Layer w0.254: R10.2 64.47,75.41 54.61,85.27 46.1,85.27 42.04,81.2 42.04,79.43 43.05,78.41 44.41,78.41 SMG1.2
$1N1419: length 28.9
  Top Layer w0.254: SMG1.1 47.33,83.87 54.99,83.87 58.93,79.93 R11.2
$1N1425: length 29.6
  Top Layer w0.254: v1(55.37,78.03) 55.37,71.44 R12.2
  Bottom Layer w0.254: v1(55.37,78.03) 55.37,79.68 55.3,79.75 55.3,80.62 55.37,80.7 55.37,88.79 SMG1.10
$1N1432: length 13.2
  Top Layer w0.254: SMG1.5 53.81,75.41 R13.2
$1N1474: length 13.4
  Top Layer w0.254: R14.2 48.73,75.87 SMG1.3
$1N1913: length 33.4
  Top Layer w0.254: Q1.3 40.13,95.43 SMG1.12
$1N1916: length 4.9
  Top Layer w0.254: Q1.2 20.28,69.58 R15.2
$1N1920: length 35.2
  Top Layer w0.254: Q2.3 44.33,93.52 49.91,93.52 51.27,94.88 SMG1.9
$1N1925: length 30.5
  Top Layer w0.254: Q3.3 53.22,95.43 SMG1.8
$1N1934: length 24.8
  Top Layer w0.254: SMG1.6 54.19,82.35 v1(53.34,82.35) ; v1(40.64,81.08) 40.64,76.5 Q4.3
  Bottom Layer w0.254: v1(53.34,82.35) 41.91,82.35 v1(40.64,81.08)
$1N1943: length 5.1
  Top Layer w0.254: R16.2 26.37,70.14 Q2.2
$1N1945: length 5.7
  Top Layer w0.254: R17.2 33.36,71.58 Q3.2
$1N1947: length 6.1
  Top Layer w0.254: R18.2 39.71,72.39 Q4.2
$1N2445: length 14.4
  Top Layer w0.254: SW1.2 7.44,39.35 7.44,31.37 USB1.1
$1N2605: length 2.8
  Top Layer w0.254: LED3.2 12.19,79.5 R19.2
$1N2609: length 2.7
  Top Layer w0.254: LED1.1 R5.2
$1N2614: length 2.7
  Top Layer w0.254: LED2.1 R6.2
$1N3034: length 8.5
  Top Layer w0.254: Q5.2 81.66,48 R20.2 R21.2
$1N3101: length 19.6
  Top Layer w0.254: Q5.3 81.66,53.39 84.84,53.39 86.23,51.99 D1.2 90.96,48.63 BUZ1.2
$1N3230: length 14.3
  Top Layer w0.254: BUZ1.1 96.3,43.42 D1.1 96.44,52.13 R22.1

## Copper pours and planes (outline as drawn; the poured copper is in the pictures)
GND on Top Layer: -3.94,107.11 114.55,107.11 114.55,-6.55 -3.94,-6.55
GND on Top Layer: -17.02,109.78 125.86,109.78 125.86,-25.22 -17.02,-25.22
GND on Top Layer: -23.75,108.38 132.97,108.38 132.97,-18.36 -23.75,-18.36
GND on Top Layer: -14.48,108.51 112.01,108.51 112.01,-10.36 -14.48,-10.36
GND on Bottom Layer: -8.76,110.8 123.57,110.8 123.57,-14.68 -8.76,-14.68
GND on Bottom Layer: -11.05,107.62 105.66,107.62 105.66,-12.78 -11.05,-12.78
GND on Bottom Layer: -11.43,108.51 113.79,108.51 113.79,-12.4 -11.43,-12.4

Small or netless copper shapes (teardrops, artwork), in the pictures only: 123 on Top Layer, 19 on Bottom Layer

## Text on the board
Top Silkscreen Layer: TXD | +5V | GND | RXD | +
